# Altium schematic sheet GateWay.SchDoc
size A
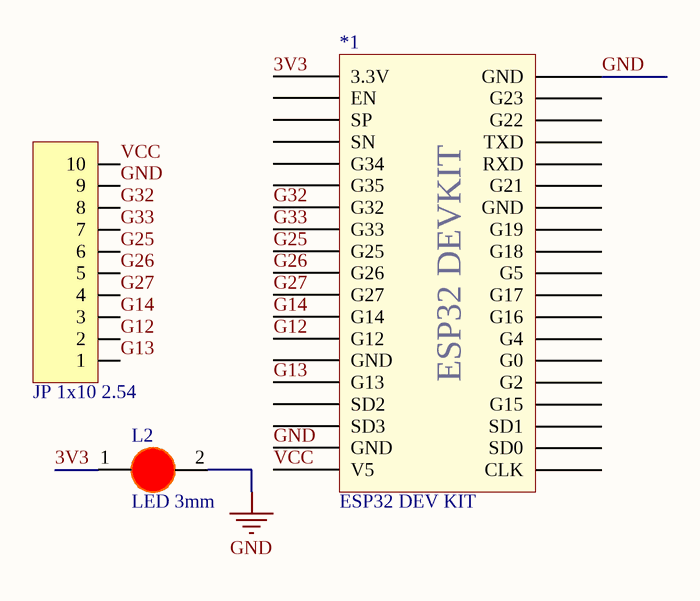
[diagram p0: GateWay.SchDoc]

## Parts
*1  ESP32 DEV KIT  [ESP32 DEVKIT]
JP5  JP 1x10 2.54  [JP 1x10 CT]
L2  LED 3mm  [LED-3MM-RED]

## Nets
GND: *1.18(GND) *1.38(GND) JP5.9 L2.2(K)
3V3: *1.1(3.3V) L2.1(A)
G12: *1.13(G12) JP5.2
G13: *1.15(G13) JP5.1
G14: *1.12(G14) JP5.3
G25: *1.9(G25) JP5.6
G26: *1.10(G26) JP5.5
G27: *1.11(G27) JP5.4
G32: *1.7(G32) JP5.8
G33: *1.8(G33) JP5.7
VCC: *1.19(V5) JP5.10

Not connected (* = marked no-connect by the designer): *1 2(EN) 3(SP) 4(SN) 5(G34) 6(G35) 14(GND) 16(SD2) 17(SD3) 20(CLK) 21(SD0) 22(SD1) 23(G15) 24(G2) 25(G0) 26(G4) 27(G16) 28(G17) 29(G5) 30(G18) 31(G19) 32(GND) 33(G21) 34(RXD) 35(TXD) 36(G22) 37(G23)

## Notes on the sheet
- (in symbol ESP32 DEV KIT) ESP32 DEVKIT

## Library data of the parts
JP5 = JP 1x10 2.54 Cai Thang: Cắm; Ten_Linh_Kien: Jump Đơn Cái 2.54MM 1x20P Thẳng; Don_Vi: Con; Ma_Hang: MH004006; Ghi_Chu: *; Kieu_Chan: *; Chung_Loai: Cắm
L2 = LED 3mm Do: Cắm; Don_Vi: Con; Ma_Hang: MH003892; Ten_Linh_Kien: Led 3MM Phủ Đỏ (10c); Ghi_Chu: *; Kieu_Chan: *; Chung_Loai: Cắm